# Altium schematic sheet 08-STM32-01.SchDoc
size B; SheetNumber: 8; SheetTotal: 19
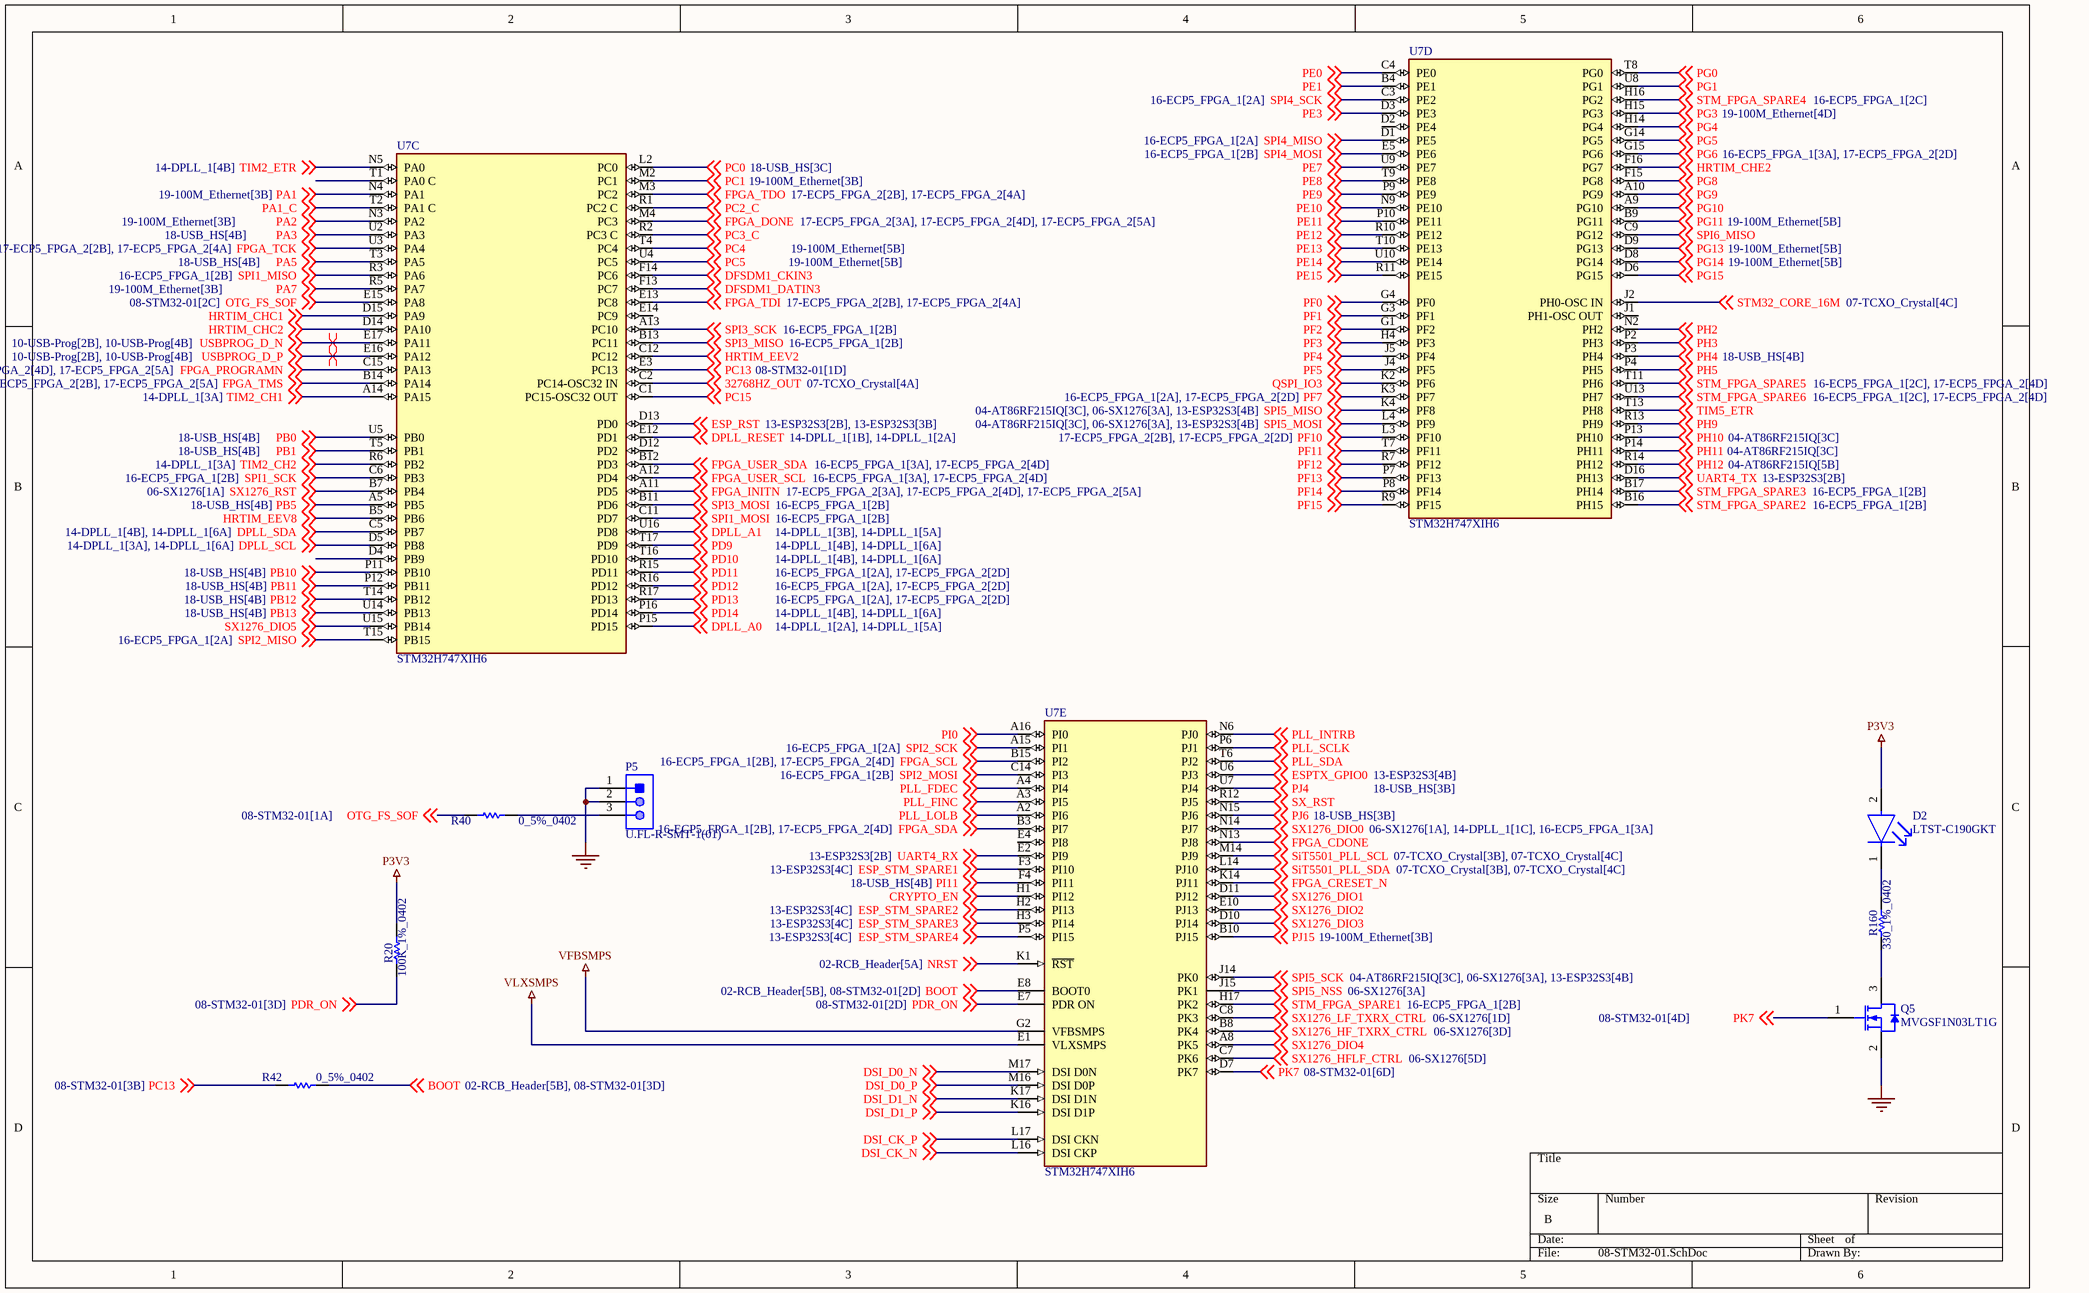
[diagram p0: 08-STM32-01.SchDoc]

## Parts
D2  LTST-C190GKT  [FP-LTST-C190GKT-MFG]
P5  U.FL-R-SMT-1(01)  [HRS-U.FL-R-SMT-3_V]
Q5  MVGSF1N03LT1G  [ONSC-SOT-23-3-318-08_V]
R20  100K_1%_0402  [RESC1005X40X25ML05T10]
R40  0_5%_0402  [RESC1005X40X25NL05T10]
R42  0_5%_0402  [RESC1005X40X25NL05T10]
R160  330_1%_0402  [RESC1005X40X25NL10T10]
U7  STM32H747XIH6  [FP-TFBGA240+25-A07U-MFG]  (parts C,D,E of 5)

## Nets
GND: P5.1 P5.2 Q5.2(S)
P3V3: D2.2(A) R20.2
VFBSMPS: U7.G2(VFBSMPS)
VLXSMPS: U7.E1(VLXSMPS)
32768HZ_OUT: U7.C2(PC14-OSC32_IN) ; off-sheet 32768HZ_OUT
BOOT: R42.2 U7.E8(BOOT0) ; off-sheet BOOT
CRYPTO_EN: U7.H1(PI12) ; off-sheet CRYPTO_EN
DFSDM1_CKIN3: U7.F14(PC6) ; off-sheet DFSDM1_CKIN3
DFSDM1_DATIN3: U7.F13(PC7) ; off-sheet DFSDM1_DATIN3
DPLL_A0: U7.P15(PD15) ; off-sheet DPLL_A0
DPLL_A1: U7.U16(PD8) ; off-sheet DPLL_A1
DPLL_RESET: U7.E12(PD1) ; off-sheet DPLL_RESET
DPLL_SCL: U7.D5(PB8) ; off-sheet DPLL_SCL
DPLL_SDA: U7.C5(PB7) ; off-sheet DPLL_SDA
DSI_CK_N: U7.L16(DSI_CKP) ; off-sheet DSI_CK_N
DSI_CK_P: U7.L17(DSI_CKN) ; off-sheet DSI_CK_P
DSI_D0_N: U7.M17(DSI_D0N) ; off-sheet DSI_D0_N
DSI_D0_P: U7.M16(DSI_D0P) ; off-sheet DSI_D0_P
DSI_D1_N: U7.K17(DSI_D1N) ; off-sheet DSI_D1_N
DSI_D1_P: U7.K16(DSI_D1P) ; off-sheet DSI_D1_P
ESP_RST: U7.D13(PD0) ; off-sheet ESP_RST
ESP_STM_SPARE1: U7.F3(PI10) ; off-sheet ESP_STM_SPARE1
ESP_STM_SPARE2: U7.H2(PI13) ; off-sheet ESP_STM_SPARE2
ESP_STM_SPARE3: U7.H3(PI14) ; off-sheet ESP_STM_SPARE3
ESP_STM_SPARE4: U7.P5(PI15) ; off-sheet ESP_STM_SPARE4
ESPTX_GPIO0: U7.U6(PJ3) ; off-sheet ESPTX_GPIO0
FPGA_CDONE: U7.N13(PJ8) ; off-sheet FPGA_CDONE
FPGA_CRESET_N: U7.K14(PJ11) ; off-sheet FPGA_CRESET_N
FPGA_DONE: U7.M4(PC3) ; off-sheet FPGA_DONE
FPGA_INITN: U7.A11(PD5) ; off-sheet FPGA_INITN
FPGA_PROGRAMN: U7.C15(PA13) ; off-sheet FPGA_PROGRAMN
FPGA_SCL: U7.B15(PI2) ; off-sheet FPGA_SCL
FPGA_SDA: U7.B3(PI7) ; off-sheet FPGA_SDA
FPGA_TCK: U7.U3(PA4) ; off-sheet FPGA_TCK
FPGA_TDI: U7.E13(PC8) ; off-sheet FPGA_TDI
FPGA_TDO: U7.M3(PC2) ; off-sheet FPGA_TDO
FPGA_TMS: U7.B14(PA14) ; off-sheet FPGA_TMS
FPGA_USER_SCL: U7.A12(PD4) ; off-sheet FPGA_USER_SCL
FPGA_USER_SDA: U7.B12(PD3) ; off-sheet FPGA_USER_SDA
HRTIM_CHC1: U7.D15(PA9) ; off-sheet HRTIM_CHC1
HRTIM_CHC2: U7.D14(PA10) ; off-sheet HRTIM_CHC2
HRTIM_CHE2: U7.F16(PG7) ; off-sheet HRTIM_CHE2
HRTIM_EEV2: U7.C12(PC12) ; off-sheet HRTIM_EEV2
HRTIM_EEV8: U7.B5(PB6) ; off-sheet HRTIM_EEV8
NRST: U7.K1(~{RST}) ; off-sheet NRST
OTG_FS_SOF: R40.1 U7.E15(PA8) ; off-sheet OTG_FS_SOF
PA1: U7.N4(PA1) ; off-sheet PA1
PA1_C: U7.T2(PA1_C) ; off-sheet PA1_C
PA2: U7.N3(PA2) ; off-sheet PA2
PA3: U7.U2(PA3) ; off-sheet PA3
PA5: U7.T3(PA5) ; off-sheet PA5
PA7: U7.R5(PA7) ; off-sheet PA7
PB0: U7.U5(PB0) ; off-sheet PB0
PB1: U7.T5(PB1) ; off-sheet PB1
PB5: U7.A5(PB5) ; off-sheet PB5
PB10: U7.P11(PB10) ; off-sheet PB10
PB11: U7.P12(PB11) ; off-sheet PB11
PB12: U7.T14(PB12) ; off-sheet PB12
PB13: U7.U14(PB13) ; off-sheet PB13
PC0: U7.L2(PC0) ; off-sheet PC0
PC1: U7.M2(PC1) ; off-sheet PC1
PC2_C: U7.R1(PC2_C) ; off-sheet PC2_C
PC3_C: U7.R2(PC3_C) ; off-sheet PC3_C
PC4: U7.T4(PC4) ; off-sheet PC4
PC5: U7.U4(PC5) ; off-sheet PC5
PC13: R42.1 U7.E3(PC13) ; off-sheet PC13
PC15: U7.C1(PC15-OSC32_OUT) ; off-sheet PC15
PD9: U7.T17(PD9) ; off-sheet PD9
PD10: U7.T16(PD10) ; off-sheet PD10
PD11: U7.R15(PD11) ; off-sheet PD11
PD12: U7.R16(PD12) ; off-sheet PD12
PD13: U7.R17(PD13) ; off-sheet PD13
PD14: U7.P16(PD14) ; off-sheet PD14
PDR_ON: R20.1 U7.E7(PDR_ON) ; off-sheet PDR_ON
PE0: U7.C4(PE0) ; off-sheet PE0
PE1: U7.B4(PE1) ; off-sheet PE1
PE3: U7.D3(PE3) ; off-sheet PE3
PE7: U7.U9(PE7) ; off-sheet PE7
PE8: U7.T9(PE8) ; off-sheet PE8
PE9: U7.P9(PE9) ; off-sheet PE9
PE10: U7.N9(PE10) ; off-sheet PE10
PE11: U7.P10(PE11) ; off-sheet PE11
PE12: U7.R10(PE12) ; off-sheet PE12
PE13: U7.T10(PE13) ; off-sheet PE13
PE14: U7.U10(PE14) ; off-sheet PE14
PE15: U7.R11(PE15) ; off-sheet PE15
PF0: U7.G4(PF0) ; off-sheet PF0
PF1: U7.G3(PF1) ; off-sheet PF1
PF2: U7.G1(PF2) ; off-sheet PF2
PF3: U7.H4(PF3) ; off-sheet PF3
PF4: U7.J5(PF4) ; off-sheet PF4
PF5: U7.J4(PF5) ; off-sheet PF5
PF7: U7.K3(PF7) ; off-sheet PF7
PF10: U7.L3(PF10) ; off-sheet PF10
PF11: U7.T7(PF11) ; off-sheet PF11
PF12: U7.R7(PF12) ; off-sheet PF12
PF13: U7.P7(PF13) ; off-sheet PF13
PF14: U7.P8(PF14) ; off-sheet PF14
PF15: U7.R9(PF15) ; off-sheet PF15
PG0: U7.T8(PG0) ; off-sheet PG0
PG1: U7.U8(PG1) ; off-sheet PG1
PG3: U7.H15(PG3) ; off-sheet PG3
PG4: U7.H14(PG4) ; off-sheet PG4
PG5: U7.G14(PG5) ; off-sheet PG5
PG6: U7.G15(PG6) ; off-sheet PG6
PG8: U7.F15(PG8) ; off-sheet PG8
PG9: U7.A10(PG9) ; off-sheet PG9
PG10: U7.A9(PG10) ; off-sheet PG10
PG11: U7.B9(PG11) ; off-sheet PG11
PG13: U7.D9(PG13) ; off-sheet PG13
PG14: U7.D8(PG14) ; off-sheet PG14
PG15: U7.D6(PG15) ; off-sheet PG15
PH2: U7.N2(PH2) ; off-sheet PH2
PH3: U7.P2(PH3) ; off-sheet PH3
PH4: U7.P3(PH4) ; off-sheet PH4
PH5: U7.P4(PH5) ; off-sheet PH5
PH9: U7.R13(PH9) ; off-sheet PH9
PH10: U7.P13(PH10) ; off-sheet PH10
PH11: U7.P14(PH11) ; off-sheet PH11
PH12: U7.R14(PH12) ; off-sheet PH12
PI0: U7.A16(PI0) ; off-sheet PI0
PI11: U7.F4(PI11) ; off-sheet PI11
PJ4: U7.U7(PJ4) ; off-sheet PJ4
PJ6: U7.N15(PJ6) ; off-sheet PJ6
PJ15: U7.B10(PJ15) ; off-sheet PJ15
PK7: Q5.1(G) U7.D7(PK7) ; off-sheet PK7
PLL_FDEC: U7.A4(PI4) ; off-sheet PLL_FDEC
PLL_FINC: U7.A3(PI5) ; off-sheet PLL_FINC
PLL_INTRB: U7.N6(PJ0) ; off-sheet PLL_INTRB
PLL_LOLB: U7.A2(PI6) ; off-sheet PLL_LOLB
PLL_SCLK: U7.P6(PJ1) ; off-sheet PLL_SCLK
PLL_SDA: U7.T6(PJ2) ; off-sheet PLL_SDA
QSPI_IO3: U7.K2(PF6) ; off-sheet QSPI_IO3
SiT5501_PLL_SCL: U7.M14(PJ9) ; off-sheet SiT5501_PLL_SCL
SiT5501_PLL_SDA: U7.L14(PJ10) ; off-sheet SiT5501_PLL_SDA
SPI1_MISO: U7.R3(PA6) ; off-sheet SPI1_MISO
SPI1_MOSI: U7.C11(PD7) ; off-sheet SPI1_MOSI
SPI1_SCK: U7.C6(PB3) ; off-sheet SPI1_SCK
SPI2_MISO: U7.T15(PB15) ; off-sheet SPI2_MISO
SPI2_MOSI: U7.C14(PI3) ; off-sheet SPI2_MOSI
SPI2_SCK: U7.A15(PI1) ; off-sheet SPI2_SCK
SPI3_MISO: U7.B13(PC11) ; off-sheet SPI3_MISO
SPI3_MOSI: U7.B11(PD6) ; off-sheet SPI3_MOSI
SPI3_SCK: U7.A13(PC10) ; off-sheet SPI3_SCK
SPI4_MISO: U7.D1(PE5) ; off-sheet SPI4_MISO
SPI4_MOSI: U7.E5(PE6) ; off-sheet SPI4_MOSI
SPI4_SCK: U7.C3(PE2) ; off-sheet SPI4_SCK
SPI5_MISO: U7.K4(PF8) ; off-sheet SPI5_MISO
SPI5_MOSI: U7.L4(PF9) ; off-sheet SPI5_MOSI
SPI5_NSS: U7.J15(PK1) ; off-sheet SPI5_NSS
SPI5_SCK: U7.J14(PK0) ; off-sheet SPI5_SCK
SPI6_MISO: U7.C9(PG12) ; off-sheet SPI6_MISO
STM32_CORE_16M: U7.J2(PH0-OSC_IN) ; off-sheet STM32_CORE_16M
STM_FPGA_SPARE1: U7.H17(PK2) ; off-sheet STM_FPGA_SPARE1
STM_FPGA_SPARE2: U7.B16(PH15) ; off-sheet STM_FPGA_SPARE2
STM_FPGA_SPARE3: U7.B17(PH14) ; off-sheet STM_FPGA_SPARE3
STM_FPGA_SPARE4: U7.H16(PG2) ; off-sheet STM_FPGA_SPARE4
STM_FPGA_SPARE5: U7.T11(PH6) ; off-sheet STM_FPGA_SPARE5
STM_FPGA_SPARE6: U7.U13(PH7) ; off-sheet STM_FPGA_SPARE6
SX1276_DIO0: U7.N14(PJ7) ; off-sheet SX1276_DIO0
SX1276_DIO1: U7.D11(PJ12) ; off-sheet SX1276_DIO1
SX1276_DIO2: U7.E10(PJ13) ; off-sheet SX1276_DIO2
SX1276_DIO3: U7.D10(PJ14) ; off-sheet SX1276_DIO3
SX1276_DIO4: U7.A8(PK5) ; off-sheet SX1276_DIO4
SX1276_DIO5: U7.U15(PB14) ; off-sheet SX1276_DIO5
SX1276_HF_TXRX_CTRL: U7.B8(PK4) ; off-sheet SX1276_HF_TXRX_CTRL
SX1276_HFLF_CTRL: U7.C7(PK6) ; off-sheet SX1276_HFLF_CTRL
SX1276_LF_TXRX_CTRL: U7.C8(PK3) ; off-sheet SX1276_LF_TXRX_CTRL
SX1276_RST: U7.B7(PB4) ; off-sheet SX1276_RST
SX_RST: U7.R12(PJ5) ; off-sheet SX_RST
TIM2_CH1: U7.A14(PA15) ; off-sheet TIM2_CH1
TIM2_CH2: U7.R6(PB2) ; off-sheet TIM2_CH2
TIM2_ETR: U7.N5(PA0) ; off-sheet TIM2_ETR
TIM5_ETR: U7.T13(PH8) ; off-sheet TIM5_ETR
UART4_RX: U7.E2(PI9) ; off-sheet UART4_RX
UART4_TX: U7.D16(PH13) ; off-sheet UART4_TX
USBPROG_D_N: U7.E17(PA11) ; off-sheet USBPROG_D_N
USBPROG_D_P: U7.E16(PA12) ; off-sheet USBPROG_D_P
NetD2_1: D2.1(C) R160.2
NetP5_3: P5.3 R40.2
NetQ5_3: Q5.3(D) R160.1

Not connected (* = marked no-connect by the designer): U7 D2(PE4) D4(PB9) D12(PD2) E4(PI8) E14(PC9) J1(PH1-OSC_OUT) T1(PA0_C)

## Layout directives
differential pair: USBPROG_D_N, USBPROG_D_P

## Library data of the parts
D2 = CMP-22017-000005-2: LED GREEN CLEAR CHIP SMD; Dominant Wavelength: 569nm; Reverse Voltage: 5V; Lens Color: Colorless; Viewing Angle: 130°; Voltage: 2V; Forward Current: 30mA; Power Dissipation: 100mW; Luminous Intensity: 6mcd; Number of LEDs: 1; Forward Voltage: 2.1V; Wavelength: 565nm; Test Current: 10mA; Min Operating Temperature: -55°C; Lens Style: Clear; Mount: Surface Mount; Width: 0.8mm; Packaging: Tape and Reel; Lens Transparency: Clear; Case Code (Metric): 1608; Depth: 0.8mm; Case Code (Imperial): 0603; Case/Package: 0603; Number of Pins: 2; Max Operating Temperature: 85°C; Lead Free: Lead Free; Number of Elements: 1; Length: 1.6mm; Height: 0.8mm; Package Quantity: 1; Power Rating: 100mW; Radiation Hardening: No; Illumination Color: Green; Color: Green
P5 = CMP-2000-05153-1: Ultra Small Coaxial Connector, 6 GHz, -40 to 90 degC, 3-Pin SMD, RoHS, Bulk; Manufacturer: Hirose Electric; Connector Style: U.FL; Impedance: 50Ohm; Dielectric Material: LiquidCrystalPolymer(LCP); Minimum Quantity: UltraMiniatureCoaxial; Online Catalog: U.FLSeries; Featured Product: HiroseU.FLSeries; Frequency - Max: 6GHz; Other Names: H122041 / U.FL-R-SMT-1(01)-ND; Contact Termination: Solder; Body Material: PhosphorBronze; Connector Type: Jack,MalePin; Body Finish: Silver; Center Contact Plating: Gold; Manufacturer URL: https://www.hirose.com; Family: CoaxialConnectors(RF); Fastening Type: Snap-On; Unit PriceUSD: U.FL; Series: U.FL; Package Reference: U.FL-R-SMT; Packaging: Bulk; Standard Package: 100; Mounting Type: SurfaceMount; Quantity Available: Bulk; Housing Color: Silver; Package Description: 3-Pin Surface Mount Device, Body 2.6 x 2.6 mm; Category: Connectors,Interconnects; Operating Temperature: -40degC~90degC; Center Contact Material: PhosphorBronze; Dynamic Catalog: U.FLSeries; Datasheet URL: https://datasheet.ciiva.com/26945/getdatasheetpartid-475239-26945414.pdf; Datasheet Version: Feb-09; Shield Termination: Solder
Q5 = CMP-1058-00779-1: Power MOSFET, 30 V, 2.1 A, Single N-Channel, 3-Pin SOT-23, Pb-Free, Tape and Reel; Manufacturer: On Semiconductor; V(BR)DSS Min (V): 30; VGS(th) Max (V): 2.4; Ciss Typ (pF): 140; VGS Max (V): 20; Channel Polarity: N Channel; ID Max (A): 2.1; Coss Typ (pF): 100; Crss Typ (pF): 40; ComponentLink3URL: http://www.onsemi.cn/pub_link/Collateral/318-08.PDF; Configuration: Single; PackageDescription: 3-Pin Small Outline Transistor, Body 2.92 x 1.3 mm, Pitch 0.95 mm; Packing: Tape and Reel; PartNumber: MVGSF1N03LT1G; ComponentLink2URL: http://www.onsemi.cn/pub_link/Collateral/MGSF1N03LT1-D.PDF; PackageVersion: Rev. AP, 11/2009; ComponentLink3Description: Package Specification; Package Type: SOT-23-3; ComponentLink1Description: Manufacturer URL; DatasheetVersion: Rev. 10; PackageReference: SOT-23-3-318-08; ComponentLink2Description: Datasheet; ComponentLink1URL: http://www.onsemi.com/; RoHS: Pb-Free; Mounting Technology: Surface Mount
R20 = CMP-2002-07852-1: Manufacturer: Yageo; Part Number: RC0402FR-13100KL
R40 R42 = CMP-2002-06457-1: Manufacturer: Panasonic; Part Number: ERJ-U020R00X
R160 = CMP-2002-05853-1: Manufacturer: Panasonic; Part Number: ERA-2AED331X
U7 = CMP-12105-000055-1: HIGH-PERFORMANCE AND DSP WITH DP; Manufacturer: STMicroelectronics; Number Of Uart Channels: 9; Number Of Pwm Channels: 2; Memory Size: 2MBytes; Number Of Ethernet Channels: 1; Ram Size: 1MBytes; Number Of Timers/Counters: 22; Data Bus Width: 32bits; Core Architecture: ARM Cortex-M4, ARM Cortex-M7; Interface: I2C,SPI,UART,USART,CAN,USB,LIN,IrDA,Ethernet,I2S,SMBus,Other; Number Of Adc Channels: 36; Min Supply Voltage: 1.2V; Number Of A/D Converters: 3; Number Of Spi Channels: 6; Max Supply Voltage: 3.6V; Frequency: 480MHz; Memory Type: FLASH; Number Of I2C Channels: 4; Max Junction Temp: +125°C; Standoff Height: 0.15mm; Number Of I/Os: 168; Device Class L2: Embedded Processors and Controllers; Digikey Description: HIGH-PERFORMANCE AND DSP WITH DP; RoHS: TRUE; Lead Free: Yes; Manufacturer Part Number: STM32H747XIH6; ComponentLink2URL: https://www.st.com/resource/en/datasheet/stm32h747xi.pdf; Mouser Description: STM32 Series 2 MB Flash 1 MB RAM 480 MHz 32-Bit Microcontroller - TFBGA-265; Device Class L1: Integrated Circuits (ICs); Ipc Land Pattern Name: BGA289N80P17X17_1400X1400X110; Category: IC; Device Class L3: Microcontrollers; Ambient Temperature Range High: +85°C; Number Of Cores: 2; Temperature Range High: +125°C; ComponentLink2Description: Datasheet; Automotive: No; Ambient Temperature Range Low: -40°C; Package: TFBGA240+25-A07U; Temperature: -40°C to +125°C; Number Of Usb Channels: 2; Temperature Range Low: -40°C; Height: 1.1mm; Octopart: https://octopart.com/stm32h747xih6-stmicroelectronics-100293943